# EasyEDA Pro project 双路12usb诱骗加热温控.eprj

# Schematic Schematic1
Board Name: Board1; Create Date: 2025-01-06; Page Name: P1; Project Name: 双路12usb诱骗加热温控; Schematic Name: Schematic1; Update Date: 2025-01-14; Company: 嘉立创EDA; Page Size: A4; Version: V1.0
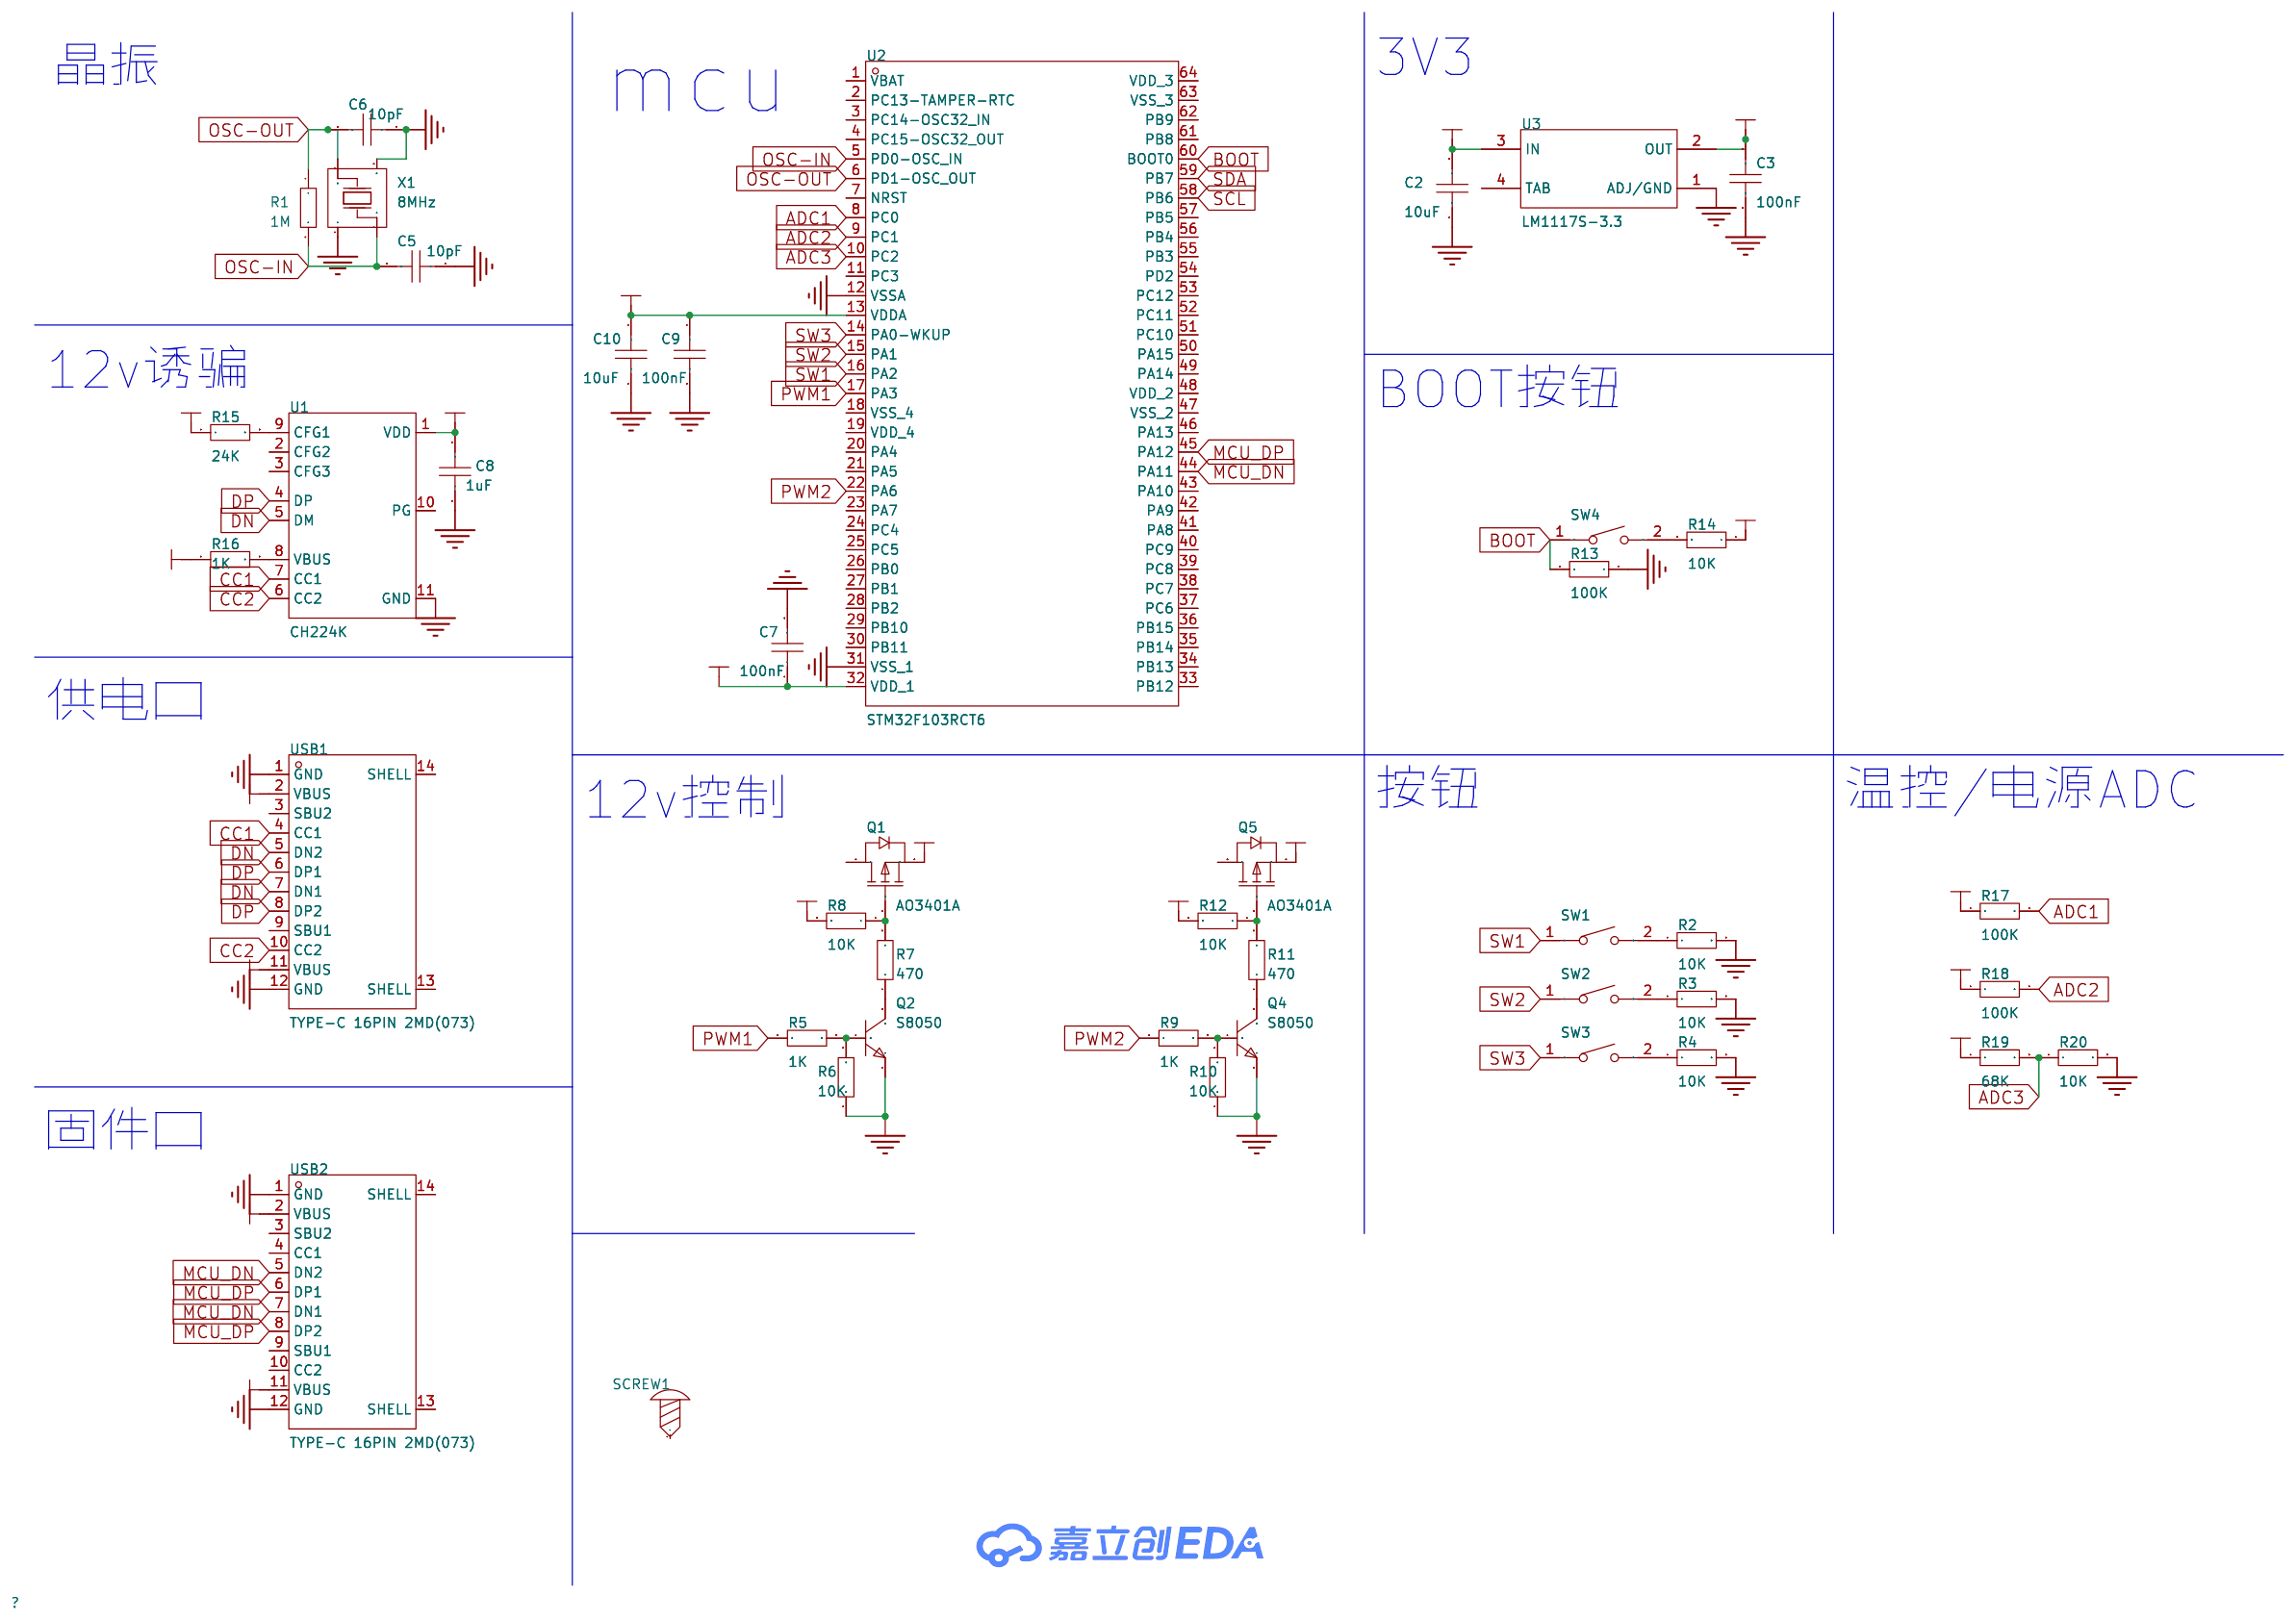
[diagram p0: schematic sheet]

## Parts
C2  10uF  [C0603]
C3  100nF  [C0603]
C5  10pF  [C0603]
C6  10pF  [C0603]
C7  100nF  [C0603]
C8  1uF  [C0603]
C9  100nF  [C0603]
C10  10uF  [C0603]
Q1  AO3401A  [SOT-23_L2.9-W1.3-P1.90-LS2.4-BR]
Q2  S8050  [SOT-23-3_L2.9-W1.3-P1.90-LS2.3-BR]
Q4  S8050  [SOT-23-3_L2.9-W1.3-P1.90-LS2.3-BR]
Q5  AO3401A  [SOT-23_L2.9-W1.3-P1.90-LS2.4-BR]
R1  1M  [R0603]
R2  10K  [R0603]
R3  10K  [R0603]
R4  10K  [R0603]
R5  1K  [R0603]
R6  10K  [R0603]
R7  470  [R0603]
R8  10K  [R0603]
R9  1K  [R0603]
R10  10K  [R0603]
R11  470  [R0603]
R12  10K  [R0603]
R13  100K  [R0603]
R14  10K  [R0603]
R15  24K  [R0603]
R16  1K  [R0603]
R17  100K  [R0603]
R18  100K  [R0603]
R19  68K  [R0603]
R20  10K  [R0603]
SCREW1  -  [M2螺丝]
SW1  TS-1088-AR02016  [SW-SMD_L3.9-W3.0-P4.45]
SW2  TS-1088-AR02016  [SW-SMD_L3.9-W3.0-P4.45]
SW3  TS-1088-AR02016  [SW-SMD_L3.9-W3.0-P4.45]
SW4  TS-1088-AR02016  [SW-SMD_L3.9-W3.0-P4.45]
U1  CH224K  [ESSOP-10_L4.9-W3.9-P1.0-LS6.0-TL-EP]
U2  STM32F103RCT6  [LQFP-64_L10.0-W10.0-P0.50-LS12.0-BL]
U3  LM1117S-3.3  [SOT-223-3_L6.5-W3.4-P2.30-LS7.0-BR]
USB1  TYPE-C 16PIN 2MD(073)  [USB-C-SMD_TYPE-C-6PIN-2MD-073]
USB2  TYPE-C 16PIN 2MD(073)  [USB-C-SMD_TYPE-C-6PIN-2MD-073]
X1  8MHz  [CRYSTAL-SMD_4P-L3.2-W2.5-BL]

## Library data of the parts
C2 C3 C5-C10 = CAP_0603: Supplier Footprint: 0603
Q1 Q5 = AO3401A_C15127: LCSC Part Name: 1个P沟道 耐压:30V 电流:4A; Supplier Part: C15127; Manufacturer: AOS; Supplier Footprint: SOT-23; JLCPCB Part Class: 基础库; Datasheet: https://atta.szlcsc.com/upload/public/pdf/source/20160507/1462613609053.pdf; Supplier: LCSC; Type: 1个P沟道; Drain Source Voltage (Vdss): 30V; Continuous Drain Current (Id): 4A; Drain Source On Resistance (RDS(on)@Vgs,Id): 44mΩ@10V,4.3A; Power Dissipation (Pd): 1.4W; Gate Threshold Voltage (Vgs(th)@Id): 1.3V@250uA; Total Gate Charge (Qg@Vgs): 12.2nC@4.5V; Input Capacitance (Ciss@Vds): 1.2nF@15V; Operating Temperature: -55℃~+150℃@(Tj)
Q2 Q4 = S8050_C20069125: LCSC Part Name: hFE:200-350，丝印:J3Y; Supplier Part: C20069125; Manufacturer: 宏迦橙; Supplier Footprint: SOT-23; JLCPCB Part Class: 扩展库; Datasheet: https://atta.szlcsc.com/upload/public/pdf/source/20240403/2D78449C96B6E27F13BF8BDF79E27159.pdf; Supplier: LCSC; Transistor Type: NPN; Collector Current (Ic): 500mA; Collector-Emitter Breakdown Voltage (Vceo): 25V; Power Dissipation (Pd): 300mW; DC Current Gain (hFE@Ic,Vce): 120@50mA,1.0V; Transition Frequency (fT): 100MHz; Collector Cut-Off Current (Icbo): 100nA; Collector-Emitter Saturation Voltage (VCE(sat)@Ic,Ib): 600mV@500mA,50mA; Operating Temperature: -55℃~+150℃
R1-R20 = Res_0603: Supplier Footprint: 0603
SCREW1 = M2螺丝: Supplier Footprint: 插件
SW1-SW4 = TS-1088-AR02016: LCSC Part Name: 4*3*2mm 立贴 轻触开关; Supplier Part: C720477; Manufacturer: XUNPU(讯普); Supplier Footprint: SMD; JLCPCB Part Class: 扩展库; Datasheet: https://atta.szlcsc.com/upload/public/pdf/source/20200810/C720475_60D09DD6C54279ADDB2DC25100F1CC11.pdf; Supplier: LCSC; Circuit: 单刀单掷; Actuator Style: 圆形按钮; Operating Force: 160gf; Mounting Style: 立贴; Switch Length: 4mm; Switch Width: 3mm; Switch Height: 2mm; Strike Gundam: 不带; Contact Current: 50mA; Voltage Rating (DC): 12V; Insulation Resistance: 100MΩ; Actuator/Cap Color: 黑色; Pin Style: SMD接片; Mechanical Life: 10万次; Operating Temperature: -30℃~+80℃
U1 = CH224K: LCSC Part Name: USBPD等多快充协议受电芯片CH224; Supplier Part: C970725; Manufacturer: WCH(南京沁恒); Supplier Footprint: ESSOP-10-150mil-1mm; JLCPCB Part Class: 扩展库; Datasheet: https://atta.szlcsc.com/upload/public/pdf/source/20240313/43C2AFDDBDD1F65B60386D2CCAB0811B.pdf; Supplier: LCSC
U2 = STM32F103RCT6: LCSC Part Name: 主流增强型ARM Cortex-M3 MCU，具有256 KB Flash、72 MHz CPU、电机控制、USB和CAN; Supplier Part: C8323; Manufacturer: ST(意法半导体); Supplier Footprint: LQFP-64(10x10); JLCPCB Part Class: 扩展库; Datasheet: https://atta.szlcsc.com/upload/public/pdf/source/20180207/C88442_15179953708671359491.pdf; Supplier: LCSC; CPU Core: ARM-M3; Program Storage Size: 256KB; RAM Size: 48KB; GPIO Ports Number: 51; Operating Voltage Range: 2V~3.6V; CPU Maximum Speed: 72MHz; Program Memory Type: FLASH; Operating Temperature Range: -40℃~+85℃; ADC (Bit): 12bit; DAC (Bit): 12bit; Universal Serial Bus: 有; Peripheral/Function: DMA；温度传感器；PWM; Watchdog: 有; Infrared Data Association: 有; Low-Voltage Detect: 有; Direct Memory Access: 有; Internal Oscillator: 有
U3 = LM1117S-3.3: LCSC Part Name: 输入12V 输出3.3V 1A; Supplier Part: C126027; Manufacturer: HTC; Supplier Footprint: SOT-223-3; JLCPCB Part Class: 扩展库; Datasheet: https://atta.szlcsc.com/upload/public/pdf/source/20170814/C126029_1502678374361885901.pdf; Supplier: LCSC; Output Type: 固定; Maximum Input Voltage: 12V; Output Voltage: 3.3V; MAX Output Current: 1A; Power Supply Rejection Ratio (PSRR): 75dB@(120Hz); Dropout Voltage: 1.3V@(1A); Output Polarity: 正极; Number of Outputs: 1
USB1 USB2 = TYPE-C 16PIN 2MD(073): LCSC Part Name: Type-C 母 卧贴; Supplier Part: C2765186; Manufacturer: SHOU HAN(首韩); Supplier Footprint: SMD; JLCPCB Part Class: 扩展库; Datasheet: https://atta.szlcsc.com/upload/public/pdf/source/20211123/39B17C16241EAC15C5E277BDA434118E.pdf; Supplier: LCSC; Connector Type: Type-C; Standard: USB 3.1; Gender: 母; Mounting Style: 卧贴; Number of Contacts: 16P; Number of Ports: 1; Current Rating - Power (Max): 5A; Operating Temperature Range: -25℃~+85℃; Rated Voltage (Max): 5V; Connect-Disconnect Life: 5千次; Core Colour: 黑色
X1 = TAXM8M4RDBCCT2T: LCSC Part Name: 8MHz ±10ppm 10pF; Supplier Part: C400090; Manufacturer: YJX(雅晶鑫); Supplier Footprint: SMD3225-4P; JLCPCB Part Class: 扩展库; Datasheet: https://atta.szlcsc.com/upload/public/pdf/source/20190626/C400090_CF95B89E745AFE4EF2E392EF8AC009D6.pdf; Supplier: LCSC; Crystal Type: 贴片晶振; Normal temperature Frequency Tolerance: ±10ppm; Load Capacitor: 10pF; Frequency Stability(Full temperature range): ±15ppm; Equivalent Series Resistance (ESR): 250Ω; Operating Temperature: -40℃~+85℃

## Nets
3V3: C3.2 C7.1 C9.1 C10.1 R14.1 R17.1 R18.1 U2.13(VDDA) U2.32(VDD_1) U3.2(OUT)
12V: C2.2 C8.1 Q1.2(S) Q5.2(S) R8.2 R12.2 R15.1 R16.1 R19.1 U1.1(VDD) U3.3(IN) USB1.2(VBUS) USB1.11(VBUS) USB2.2(VBUS) USB2.11(VBUS)
GND: C2.1 C3.1 C5.1 C6.1 C7.2 C8.2 C9.2 C10.2 Q2.2(E) Q4.2(E) R2.2 R3.2 R4.2 R6.1 R10.1 R13.1 R20.2 U1.11(GND) U2.12(VSSA) U2.31(VSS_1) U3.1(ADJ/GND) USB1.1(GND) USB1.12(GND) USB2.1(GND) USB2.12(GND) X1.2 X1.4
ADC1: R17.2 U2.8(PC0)
ADC2: R18.2 U2.9(PC1)
ADC3: R19.2 R20.1 U2.10(PC2)
BOOT: R13.2 SW4.1 U2.60(BOOT0)
CC1: U1.7(CC1) USB1.4(CC1)
CC2: U1.6(CC2) USB1.10(CC2)
DN: U1.5(DM) USB1.5(DN2) USB1.7(DN1)
DP: U1.4(DP) USB1.6(DP1) USB1.8(DP2)
MCU_DN: U2.44(PA11) USB2.5(DN2) USB2.7(DN1)
MCU_DP: U2.45(PA12) USB2.6(DP1) USB2.8(DP2)
OSC-IN: C5.2 R1.2 U2.5(PD0-OSC_IN) X1.1
OSC-OUT: C6.2 R1.1 U2.6(PD1-OSC_OUT) X1.3
PWM1: R5.1 U2.17(PA3)
PWM2: R9.1 U2.22(PA6)
SCL: U2.58(PB6)
SDA: U2.59(PB7)
SW1: SW1.1 U2.16(PA2)
SW2: SW2.1 U2.15(PA1)
SW3: SW3.1 U2.14(PA0-WKUP)
$1N2336: R2.1 SW1.2
$1N2362: R3.1 SW2.2
$1N2388: R4.1 SW3.2
$1N2785: Q2.1(B) R5.2 R6.2
$1N2909: Q2.3(C) R7.1
$1N2911: Q1.1(G) R7.2 R8.1
$1N3260: Q4.1(B) R9.2 R10.2
$1N3265: Q4.3(C) R11.1
$1N3267: Q5.1(G) R11.2 R12.1
$1N4506: R14.2 SW4.2
$1N5026: R15.2 U1.9(CFG1)
$1N5209: R16.2 U1.8(VBUS)

Not connected (* = marked no-connect by the designer): Q1 3(D); Q5 3(D); SCREW1 1; U1 2(CFG2) 3(CFG3) 10(PG); U2 1(VBAT) 2(PC13-TAMPER-RTC) 3(PC14-OSC32_IN) 4(PC15-OSC32_OUT) 7(NRST) 11(PC3) 18(VSS_4) 19(VDD_4) 20(PA4) 21(PA5) 23(PA7) 24(PC4) 25(PC5) 26(PB0) 27(PB1) 28(PB2) 29(PB10) 30(PB11) 33(PB12) 34(PB13) 35(PB14) 36(PB15) 37(PC6) 38(PC7) 39(PC8) 40(PC9) 41(PA8) 42(PA9) 43(PA10) 46(PA13) 47(VSS_2) 48(VDD_2) 49(PA14) 50(PA15) 51(PC10) 52(PC11) 53(PC12) 54(PD2) 55(PB3) 56(PB4) 57(PB5) 61(PB8) 62(PB9) 63(VSS_3) 64(VDD_3); U3 4(TAB); USB1 3(SBU2) 9(SBU1) 13(SHELL) 14(SHELL); USB2 3(SBU2) 4(CC1) 9(SBU1) 10(CC2) 13(SHELL) 14(SHELL)

## Notes on the sheet
- 晶振
- 3V3
- mcu
- 12v诱骗
- BOOT按钮
- 供电口
- 12v控制
- 按钮
- 温控/电源ADC
- 固件口

# Board PCB1
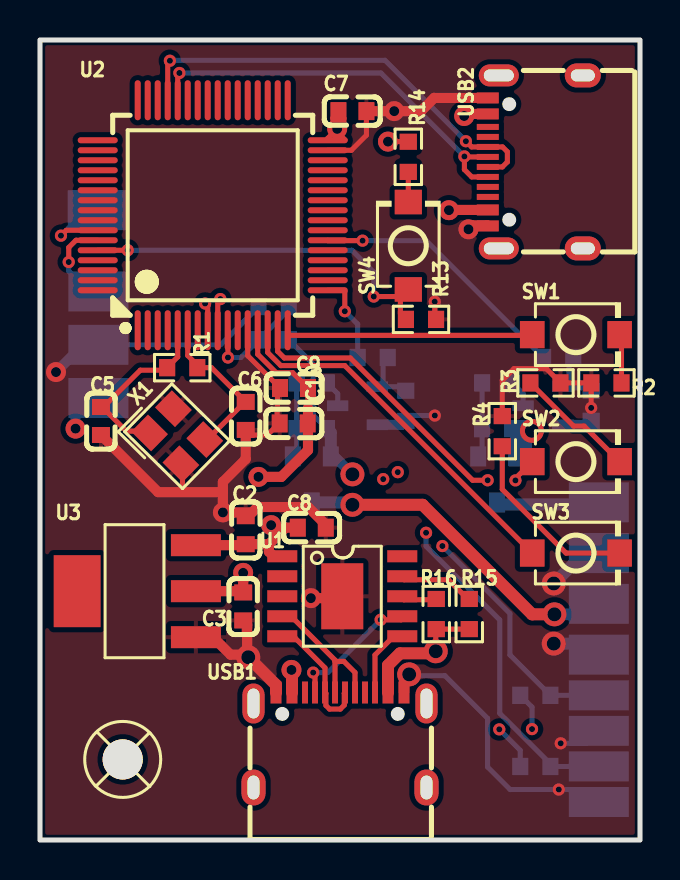
[diagram p1: board, top side]
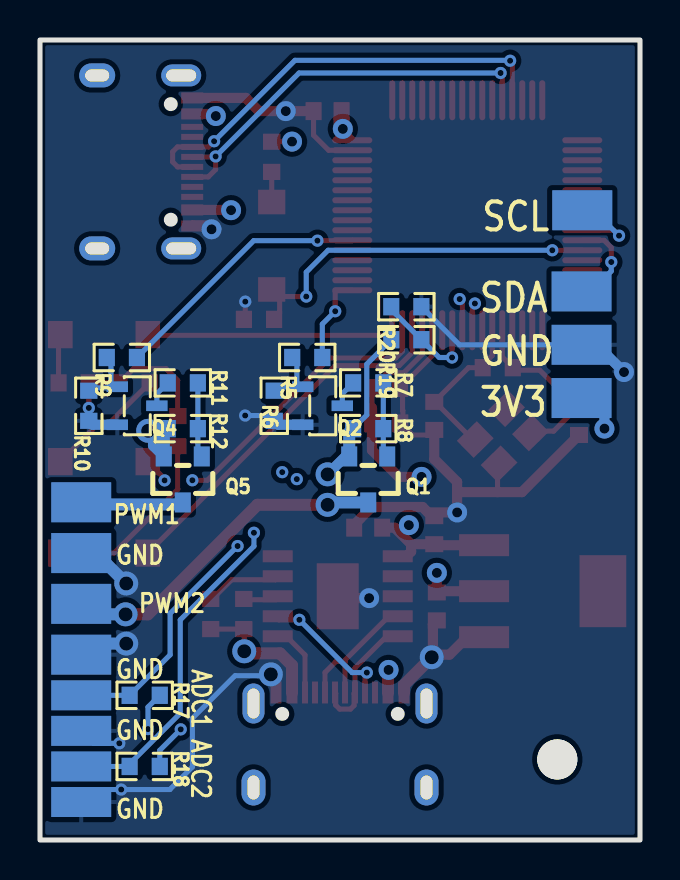
[diagram p2: board, bottom side, seen from below]

Outline 30 x 40 mm; copper layers: Top Layer, Inner1, Inner2, Bottom Layer. Coordinates in mm from the lower left corner of the outline.
Outline path: rectangle 0,40 30,0
Stack: Top Layer 0.035mm 外层铜厚1oz / Dielectric1 0.2104mm 7628 RC49% 8.6mil / Inner1 0.0152mm 内层铜厚 / Dielectric2 1.065mm 1.1mm H/HOZ Copper / Inner2 0.0152mm 内层铜厚 / Dielectric3 0.2104mm 7628 RC49% 8.6mil / Bottom Layer 0.035mm 外层铜厚1oz

## Design rules (mm)
template: 自定义配置1
spacing copperThickness1oz (default): track to track 0.102, other pairs 0.152 to 0.3
spacing copperThickness2oz: track to track 0.203, other pairs 0.152 to 0.3
spacing safeClearance1: track to track 0.152, other pairs 0.152 to 0.3
track width copperThickness1oz (default): min 0.127, default 0.254, max 2.54
track width copperThickness2oz: min 0.203, default 0.254, max 2.54
track width 10mil: min 0.254, default 0.254, max 0.254
track width 20mil: min 0.254, default 0.508, max 1
track width 6mil: min 0.152, default 0.152, max 0.152
track width 8mil: min 0.203, default 0.203, max 0.203
differential pair differentialPair (default): width min 0.127, default 0.254, max 2.54; gap min 0.152, default 0.152
via viaSize (default): diameter min 0.5, default 0.61, max 10; hole min 0.3, default 0.305, max 6.299
via 0.5-1.0: diameter min 0.5, default 1, max 1.5; hole min 0.3, default 0.5, max 1
net 12V uses 0.5-1.0, 20mil
net GND uses 0.5-1.0, 20mil
net 3V3 uses 0.5-1.0, 20mil

## Placement (name value [footprint] x y rotation side)
C2  10uF  [C0603]  10.29 15.49 270 top
C3  100nF  [C0603]  10.16 11.68 90 top
C5  10pF  [C0603]  3.05 20.95 90 top
C6  10pF  [C0603]  10.29 21.2 90 top
C7  100nF  [C0603]  15.62 36.44 0 top
C8  1uF  [C0603]  13.59 15.62 0 top
C9  100nF  [C0603]  12.7 22.6 180 top
C10  10uF  [C0603]  12.68 20.83 180 top
NOREF  -  [Pad_e78]  2.92 27.43 0 top
NOREF#2  -  [Pad_e449]  27.94 14.35 0 top
NOREF#3  -  [Pad_e79]  2.92 24.76 0 top
NOREF#4  -  [Pad_e80]  2.92 22.1 0 top
NOREF#5  -  [Pad_e99]  27.94 3.68 0 top
NOREF#6  -  [Pad_e450]  27.94 9.27 0 top
NOREF#7  -  [Pad_e75]  2.89 31.49 0 top
NOREF#8  -  [Pad_e270]  27.94 16.89 0 top
NOREF#9  -  [Pad_e98]  27.94 7.23 0 top
NOREF#10  -  [Pad_e271]  27.94 11.81 0 top
NOREF#11  -  [Pad_e101]  27.94 5.46 0 top
NOREF#12  -  [Pad_e111]  27.94 1.9 0 top
Q1  AO3401A  [SOT-23_L2.9-W1.3-P1.90-LS2.4-BR]  13.59 18.03 90 bottom
Q2  S8050  [SOT-23-3_L2.9-W1.3-P1.90-LS2.3-BR]  15.88 21.71 0 bottom
Q4  S8050  [SOT-23-3_L2.9-W1.3-P1.90-LS2.3-BR]  25.15 21.71 0 bottom
Q5  AO3401A  [SOT-23_L2.9-W1.3-P1.90-LS2.4-BR]  22.86 18.03 90 bottom
R1  1M  [R0603]  7.11 23.62 180 top
R2  10K  [R0603]  28.32 22.86 180 top
R3  10K  [R0603]  25.27 22.86 0 top
R4  10K  [R0603]  23.11 20.44 90 top
R5  1K  [R0603]  16.64 24.12 0 bottom
R6  10K  [R0603]  18.29 21.71 90 bottom
R7  470  [R0603]  13.59 22.86 180 bottom
R8  10K  [R0603]  13.59 20.57 0 bottom
R9  1K  [R0603]  25.91 24.12 0 bottom
R10  10K  [R0603]  27.56 21.71 90 bottom
R11  470  [R0603]  22.86 22.86 180 bottom
R12  10K  [R0603]  22.86 20.57 0 bottom
R13  100K  [R0603]  19.05 26.03 180 top
R14  10K  [R0603]  18.41 34.16 270 top
R15  24K  [R0603]  21.46 11.3 90 top
R16  1K  [R0603]  19.81 11.3 90 top
R17  100K  [R0603]  24.76 7.23 0 bottom
R18  100K  [R0603]  24.76 3.68 0 bottom
R19  68K  [R0603]  11.68 25.01 180 bottom
R20  10K  [R0603]  11.68 26.67 180 bottom
SCREW1  -  [M2螺丝]  4.13 4.03 0 top
SW1  TS-1088-AR02016  [SW-SMD_L3.9-W3.0-P4.45]  26.8 25.27 0 top
SW2  TS-1088-AR02016  [SW-SMD_L3.9-W3.0-P4.45]  26.8 18.92 0 top
SW3  TS-1088-AR02016  [SW-SMD_L3.9-W3.0-P4.45]  26.8 14.35 0 top
SW4  TS-1088-AR02016  [SW-SMD_L3.9-W3.0-P4.45]  18.41 29.71 90 top
U1  CH224K  [ESSOP-10_L4.9-W3.9-P1.0-LS6.0-TL-EP]  15.11 12.19 270 top
U2  STM32F103RCT6  [LQFP-64_L10.0-W10.0-P0.50-LS12.0-BL]  8.64 31.24 0 top
U3  LM1117S-3.3  [SOT-223-3_L6.5-W3.4-P2.30-LS7.0-BR]  4.83 12.44 0 top
USB1  TYPE-C 16PIN 2MD(073)  [USB-C-SMD_TYPE-C-6PIN-2MD-073]  15 5 0 top
USB2  TYPE-C 16PIN 2MD(073)  [USB-C-SMD_TYPE-C-6PIN-2MD-073]  24.76 33.9 90 top
X1  8MHz  [CRYSTAL-SMD_4P-L3.2-W2.5-BL]  6.86 20.19 315.5 top

## Footprints (pads in the part's own frame, mm; a bottom-side part is the same pattern mirrored in y, then rotated)
C0603
  rect 0.8x0.9 smd: 1(-0.7,0) 2(0.7,0)
CRYSTAL-SMD_4P-L3.2-W2.5-BL
  rect 1.4x1.2 smd: 1(-1.1,-0.85) 2(1.1,-0.85) 3(1.1,0.85) 4(-1.1,0.85)
ESSOP-10_L4.9-W3.9-P1.0-LS6.0-TL-EP
  rect 0.6x1.5 smd: 1(-2,-3) 2(-1,-3) 3(0,-3) 4(1,-3) 5(2,-3) 6(2,3) 7(1,3) 8(0,3) 9(-1,3) 10(-2,3)
  rect 3.3x2.1 smd: 11(0,0)
LQFP-64_L10.0-W10.0-P0.50-LS12.0-BL
  oval 0.3x2 smd: 1(-3.75,-5.75) 2(-3.25,-5.75) 3(-2.75,-5.75) 4(-2.25,-5.75) 5(-1.75,-5.75) 6(-1.25,-5.75) 7(-0.75,-5.75) 8(-0.25,-5.75) 9(0.25,-5.75) 10(0.75,-5.75) 11(1.25,-5.75) 12(1.75,-5.75) 13(2.25,-5.75) 14(2.75,-5.75) 15(3.25,-5.75) 16(3.75,-5.75) 33(3.75,5.75) 34(3.25,5.75) 35(2.75,5.75) 36(2.25,5.75) 37(1.75,5.75) 38(1.25,5.75) 39(0.75,5.75) 40(0.25,5.75) 41(-0.25,5.75) 42(-0.75,5.75) 43(-1.25,5.75) 44(-1.75,5.75) 45(-2.25,5.75) 46(-2.75,5.75) 47(-3.25,5.75) 48(-3.75,5.75)
  oval 2x0.3 smd: 17(5.75,-3.75) 18(5.75,-3.25) 19(5.75,-2.75) 20(5.75,-2.25) 21(5.75,-1.75) 22(5.75,-1.25) 23(5.75,-0.75) 24(5.75,-0.25) 25(5.75,0.25) 26(5.75,0.75) 27(5.75,1.25) 28(5.75,1.75) 29(5.75,2.25) 30(5.75,2.75) 31(5.75,3.25) 32(5.75,3.75) 49(-5.75,3.75) 50(-5.75,3.25) 51(-5.75,2.75) 52(-5.75,2.25) 53(-5.75,1.75) 54(-5.75,1.25) 55(-5.75,0.75) 56(-5.75,0.25) 57(-5.75,-0.25) 58(-5.75,-0.75) 59(-5.75,-1.25) 60(-5.75,-1.75) 61(-5.75,-2.25) 62(-5.75,-2.75) 63(-5.75,-3.25) 64(-5.75,-3.75)
M2螺丝
  round 2 hole 2: 1(0,0)
Pad_e75
  rect 3x2 smd far side: 1(0,0)
Pad_e78
  rect 3x2 smd far side: 1(0,0)
Pad_e79
  rect 3x2 smd far side: 1(0,0)
Pad_e80
  rect 3x2 smd far side: 1(0,0)
Pad_e98
  rect 3x1.5 smd far side: 1(0,0)
Pad_e99
  rect 3x1.5 smd far side: 1(0,0)
Pad_e101
  rect 3x1.5 smd far side: 1(0,0)
Pad_e111
  rect 3x1.5 smd far side: 1(0,0)
Pad_e270
  rect 3x2 smd far side: 1(0,0)
Pad_e271
  rect 3x2 smd far side: 1(0,0)
Pad_e449
  rect 3x2 smd far side: 1(0,0)
Pad_e450
  rect 3x2 smd far side: 1(0,0)
R0603
  rect 0.806x0.864 smd: 1(-0.753,0) 2(0.753,0)
SOT-23-3_L2.9-W1.3-P1.90-LS2.3-BR
  rect 1.07x0.532 smd: 1(0.99,-0.95) 2(0.99,0.95) 3(-0.99,0)
SOT-23_L2.9-W1.3-P1.90-LS2.4-BR
  rect 1x0.8 smd: 1(1.15,-0.95) 2(1.15,0.95) 3(-1.15,0)
SOT-223-3_L6.5-W3.4-P2.30-LS7.0-BR
  rect 2.5x1.1 smd: 1(2.97,-2.3) 2(2.97,0) 3(2.97,2.3)
  rect 2.34x3.6 smd: 4(-2.97,0)
SW-SMD_L3.9-W3.0-P4.45
  rect 1.23x1.36 smd: 1(-2.185,0) 2(2.185,0)
USB-C-SMD_TYPE-C-6PIN-2MD-073
  rect 0.55x1.1 smd: 1(-3.2,2.375) 2(-2.4,2.375) 11(2.4,2.375) 12(3.2,2.375)
  rect 0.3x1.1 smd: 3(-1.75,2.375) 4(-1.25,2.375) 5(-0.75,2.375) 6(-0.25,2.375) 7(0.25,2.375) 8(0.75,2.375) 9(1.25,2.375) 10(1.75,2.375)
  oval 1.1x2 hole 0.6x1.5: 13(-4.325,1.825) 14(4.325,1.825)
  oval 1.2x1.8 hole 0.6x1.2: 13(-4.325,-2.375) 14(4.325,-2.375)

## Nets
As in the schematic, except:
3V3: C3.2 C7.1 C9.1 C10.1 NOREF#4.1 R14.1 R17.1 R18.1 U2.13 U2.32 U3.2
GND: C2.1 C3.1 C5.1 C6.1 C7.2 C8.2 C9.2 C10.2 NOREF#2.1 NOREF#3.1 NOREF#6.1 NOREF#11.1 NOREF#12.1 Q2.2 Q4.2 R2.2 R3.2 R4.2 R6.1 R10.1 R13.1 R20.2 U1.11 U2.12 U2.31 U3.1 USB1.1 USB1.12 USB2.1 USB2.12 X1.2 X1.4
ADC1: NOREF#9.1 R17.2 U2.8
ADC2: NOREF#5.1 R18.2 U2.9
SCL: NOREF#7.1 U2.58
SDA: NOREF.1 U2.59

Pads without a net: NOREF#8 1; NOREF#10 1; Q1 3; Q5 3; SCREW1 1; U1 2 3 10; U2 1 2 3 4 7 11 18 19 20 21 23 24 25 26 27 28 29 30 33 34 35 36 37 38 39 40 41 42 43 46 47 48 49 50 51 52 53 54 55 56 57 61 62 63 64; U3 4; USB1 3 9 13 14; USB2 3 4 9 10 13 14

## Via types
v1: diameter 1.2, hole 0.7, Top Layer to Bottom Layer, 9 vias
v2: diameter 1, hole 0.5, Top Layer to Bottom Layer, 14 vias
v3: diameter 0.61, hole 0.305, Top Layer to Bottom Layer, 28 vias

## Routing (per net, layer and track width the routed paths; a pad name or vN(x,y) marks a point on that pad's centre or on a via; arc(x,y) is an arc through that point)
3V3: length 82.2
  Top Layer w0.254: 15.18,36.11 15.19,36.1 15.19,35.72 15.18,35.71 ; U2.32 14.39,35.08 v2(14.86,35.56) ; 14.91,35.56 14.65,35.82 14.65,36.1 14.65,36.1 ; 13.38,21.59 13.4,21.61 C9.1 12.64,23.36 11.81,23.36 10.89,24.29 U2.13 ; R14.1 18.41,34.92 v2(17.4,34.92) ; 15.25,35 15.06,35.2 15.06,35.28
  Top Layer w0.508: 13.4,21.61 13.4,19.49 12.06,18.16 v2(10.92,18.16) ; v2(10.16,13.36) 10.16,13.35 C3.2 10.1,12.44 U3.2
  Inner2 w0.254: v3(24.6,5.55) 24.59,5.53 v3(22.96,5.53) 14.44,5.53 11.79,8.18 11.79,11.72 v2(10.16,13.36)
  Inner2 w0.508: v2(14.86,35.56) 16.76,35.56 v2(17.4,34.92) 17.4,24.63 v2(10.92,18.16) 10.16,17.39 v2(10.16,13.36) 8.99,13.36 v2(1.78,20.57)
  Bottom Layer w0.254: v3(22.96,5.53) 24.01,4.48 R18.1 ; v3(24.6,5.55) 24.6,6.64 R17.1
  Bottom Layer w0.508: NOREF#4.1 2.42,22.1 1.78,21.46 v2(1.78,20.57)
12V: length 75.3
  Top Layer w0.254: v1(19.79,9.44) 19.79,10.52 R16.1 R15.1
  Top Layer w0.508: 11.44,14.79 12.27,15.62 C8.1 ; 11.44,14.79 11.44,14.42 11.55,14.32 ; 11.44,14.79 C2.2 10.24,14.74 U3.3 ; v2(21.21,36.2) 21.31,36.3 USB2.11 ; USB2.2 20.46,31.5 v2(20.45,31.49)
  Top Layer w0.6: USB1.2 12.6,8.48 v2(12.57,8.5) ; USB1.11 17.4,8.73 18,9.33 19.69,9.33 v1(19.79,9.44)
  Inner2 w0.508: 18.43,21.09 20.45,23.11 v2(20.45,31.49) 20.45,35.44 v2(21.21,36.2) ; v2(11.56,15.74) 14.55,15.74
  Inner2 w0.6: v2(12.57,8.5) 13.5,9.43 14.58,9.43 ; 14.57,15.76 14.57,17.23 v1(15.62,18.28) 18.43,21.09 19.06,20.46 v1(24.59,20.46) ; 14.57,15.76 14.57,9.44 14.58,9.43 ; 14.57,15.76 14.55,15.74 ; 14.58,9.43 14.58,9.44 v1(19.79,9.44)
  Bottom Layer w0.254: R8.2 13.66,21.25 13.66,23.79 R19.1
  Bottom Layer w0.508: Q1.2 14.72,19.18 v1(15.62,18.28) ; 23.69,20.75 24.29,20.75 24.34,20.7 ; 24.35,20.26 24.35,19.72 Q5.2
  Bottom Layer w0.6: Q5.2 23.81,20.37 R12.2 ; Q1.2 14.54,20.37 R8.2
GND: length 183.7
  Top Layer w0.254: U2.31 15.57,34.49 16.32,35.24 C7.2 ; 10.29,20.38 10.41,20.25 11.37,20.25 11.86,20.74 11.86,21.46 11.87,21.48 11.87,22.47 C9.2 10.39,24.22 U2.12 ; v3(27.56,21.61) 27.56,22.85 R2.2 R3.2 25.32,23.57 23.7,23.57 23.11,22.98 R4.2 ; 7.12,18.73 7.12,17.39 ; v3(19.74,26.92) 19.74,26.1 R13.1
  Top Layer w0.508: USB2.12 19.71,37.1 19.05,36.44 v2(17.71,36.44) C7.2 ; C3.1 10.36,10.78 10.36,9.59 10.03,9.27 9.53,9.27 8.65,10.14 U3.1 ; C5.1 5.9,17.39 9.14,17.39 9.14,17.4 ; 9.14,17.4 9.14,17.9 10.29,19.05 10.29,20.38 ; 9.14,17.4 v2(9.14,16.38) 10.6,16.38 10.87,16.65 13.41,16.65 14.29,15.77 C8.2 ; v2(13.54,12.09) 15.14,12.09 ; v1(18.46,8.28) 18.2,8.02 USB1.12 ; v2(21.42,30.53) 21.62,30.73 22.37,30.73 USB2.1
  Top Layer w0.6: USB1.1 11.8,7.75 10.3,9.25
  Inner1 w0.254: v3(19.74,21.22) 21.3,21.22 21.36,21.17 ; v3(27.56,21.61) 21.42,21.61 ; v3(26.03,4.83) 25.94,4.74 v3(25.94,2.52) ; v3(19.74,26.92) 21.42,26.92 21.42,26.92
  Inner1 w0.508: v2(17.71,36.44) 21.42,32.73 v2(21.42,30.53) 21.42,19.97 v2(13.54,12.09) ; v1(25.69,9.82) 24.15,8.28 v1(18.46,8.28) ; v2(13.54,12.09) 17.35,8.28 v1(18.46,8.28) ; v2(13.54,12.09) 9.26,16.38 v2(9.14,16.38) 2.92,16.38 0.8,18.5 v2(0.8,23.4) ; v2(13.54,12.09) 10.59,9.14 v1(10.41,9.14) ; v1(18.46,8.28) 18.46,11.47 19.82,12.83 v1(25.69,12.83)
  Bottom Layer w0.254: v3(19.74,21.22) 18.55,21.22 R6.1 ; v3(26.03,4.83) 27.32,4.83 NOREF#11.1 ; R20.2 9.03,24.76 NOREF#3.1 ; NOREF#12.1 27.32,2.52 v3(25.94,2.52) 23.51,2.52 22.38,3.65 22.38,6.08 20.25,8.22 18.52,8.22 v1(18.46,8.28)
  Bottom Layer w0.508: R10.1 27.36,20.76 Q4.2 ; Q2.2 18.09,20.76 R6.1 ; v2(0.8,23.4) 2.16,24.76 NOREF#3.1
  Bottom Layer w0.6: NOREF#6.1 27.39,9.82 v1(25.69,9.82) ; NOREF#2.1 27.21,14.35 v1(25.69,12.83)
(no net): length 21.8
  Top Layer w0.6: v1(25.72,11.28) 24.61,11.28 19.13,16.76 v1(15.62,16.76)
  Bottom Layer w0.6: 13.59,16.88 15.5,16.88 v1(15.62,16.76) ; 27.7,16.65 27.58,16.78 23.09,16.78 22.99,16.88 22.86,16.88 ; NOREF#10.1 27.42,11.28 v1(25.72,11.28)
ADC1: length 31.2
  Top Layer w0.254: U2.8 8.39,26.69 v3(8.25,26.83)
  Inner1 w0.254: v3(17.16,18.04) 17.16,18.08 8.41,26.83 v3(8.25,26.83)
  Inner2 w0.254: v3(20.12,14.7) 20.04,14.78 19.06,14.78 18.72,15.12 18.72,16.48 v3(17.16,18.04)
  Bottom Layer w0.254: NOREF#9.1 R17.2 23.5,9.26 23.5,11.32 v3(20.12,14.7)
ADC2: length 34.4
  Top Layer w0.254: v3(9.02,27.05) 8.89,26.92 U2.9
  Inner1 w0.254: v3(17.89,18.39) 17.76,18.39 9.11,27.05 v3(9.02,27.05)
  Inner2 w0.254: v3(17.89,18.39) 17.93,18.39 19.3,17.01 v3(19.3,15.36)
  Bottom Layer w0.254: NOREF#5.1 R18.2 25.52,3.8 22.99,6.33 22.99,11.01 19.3,14.69 v3(19.3,15.36)
ADC3: length 5.7
  Top Layer w0.254: v3(9.4,24.12) 9.4,25.48 U2.10
  Bottom Layer w0.254: 12.44,26.79 12.44,26.52 R19.2 10.04,24.12 v3(9.4,24.12)
BOOT: length 17.7
  Top Layer w0.254: 18.02,26.31 18.02,26.9 ; U2.60 v3(4.39,29.49) ; v3(16.69,27.17) 18.3,27.17
  Bottom Layer w0.254: v3(4.39,29.49) 15.59,29.49 16.69,28.39 v3(16.69,27.17)
CC1: length 6.6
  Top Layer w0.254: USB1.4 13.75,8.28 v3(13.66,8.37) ; v3(17.03,11.01) 18.06,11.01 18.14,11.09
  Bottom Layer w0.254: v3(17.03,11.01) 14.39,8.37 v3(13.66,8.37)
CC2: length 3.6
  Top Layer w0.254: USB1.10 16.75,9.25 17.59,10.09 18.14,10.09
DN: length 6.3
  Top Layer w0.254: 12.14,10.09 12.76,10.09 14.25,8.61 USB1.5 14.3,7.33 14.3,6.73 14.48,6.55 15.02,6.55 15.21,6.75 15.21,7.34 USB1.7
DP: length 7.3
  Top Layer w0.254: 12.14,11.09 12.65,11.09 14.75,8.99 14.75,8.93 ; 14.75,8.93 15.2,8.93 15.75,8.38 USB1.8 ; 14.75,8.93 USB1.6
MCU_DN: length 20.5
  Top Layer w0.254: USB2.5 21.59,33.15 21.22,33.52 v3(21.22,34.18) 21.24,34.15 USB2.7 ; v3(6.97,38.35) 6.89,38.27 U2.44
  Bottom Layer w0.254: v3(21.22,34.18) 17.05,38.35 6.97,38.35 v3(6.97,38.35)
MCU_DP: length 22.4
  Top Layer w0.254: USB2.6 23.12,33.65 23.37,33.9 23.37,34.41 23.13,34.65 USB2.8 21.58,34.65 v3(21.29,34.94) ; U2.45 6.39,38.85 v3(6.49,38.96)
  Bottom Layer w0.254: v3(21.29,34.94) 17.25,38.98 6.52,38.98 v3(6.49,38.96)
OSC-IN: length 9.2
  Top Layer w0.254: 3.11,21.65 4.32,20.44 5.52,20.44 5.6,20.35 ; 3.11,21.65 C5.2 ; 3.11,21.65 3.18,21.65 5.01,23.49 6.22,23.49 6.89,24.15 U2.5
OSC-OUT: length 7.8
  Top Layer w0.254: 8.37,20.02 10.25,21.9 C6.2 8.57,23.62 7.99,23.62 7.39,24.22 U2.6
PWM1: length 4.4
  Top Layer w0.254: U2.17 15.18,27.49 15.24,27.43 v3(15.24,26.44)
  Bottom Layer w0.254: R5.1 15.88,25.79 v3(15.24,26.44)
PWM2: length 13.2
  Top Layer w0.254: v3(16.13,29.97) 14.41,29.97 U2.22
  Bottom Layer w0.254: R9.1 19.31,29.97 v3(16.13,29.97)
SCL: length 4.3
  Top Layer w0.254: U2.58 1.32,30.49 v3(1.05,30.22)
  Bottom Layer w0.254: NOREF#7.1 2.26,30.86 1.69,30.86 v3(1.05,30.22)
SDA: length 4.7
  Top Layer w0.254: v3(1.44,28.9) 1.44,28.9 1.44,29.63 1.8,29.99 U2.59
  Bottom Layer w0.254: v3(1.44,28.9) 1.44,28.44 2.45,27.43 NOREF.1
SW1: length 12.6
  Top Layer w0.254: U2.16 12.39,25.33 12.48,25.23 24.7,25.23 24.74,25.27
SW2: length 16.9
  Top Layer w0.254: U2.15 11.89,24.43 12.22,24.1 15.52,24.1 21.63,17.99 v3(22.38,17.99) ; SW2.1 23.77,18.08 v3(23.77,17.98)
  Inner1 w0.254: v3(22.38,17.99) 23.77,17.99 v3(23.77,17.98)
SW3: length 18.5
  Top Layer w0.254: U2.14 11.39,24.38 12.04,23.72 15.24,23.72 SW3.1
$1N2336: length 2.5
  Top Layer w0.254: R2.1 29.07,25.18 SW1.2
$1N2362: length 6.1
  Top Layer w0.254: SW2.2 27.2,20.7 26.68,20.7 R3.1
$1N2388: length 9.3
  Top Layer w0.254: R4.1 23.11,17.53 26.3,14.35 SW3.2
$1N2785: length 2.9
  Bottom Layer w0.254: R5.2 17.15,23.89 17.15,22.87 ; Q2.1 18.09,22.66 R6.2
$1N2909: length 1.4
  Bottom Layer w0.254: R7.1 14.88,22.31 Q2.3
$1N2911: length 3.8
  Bottom Layer w0.254: Q1.1 12.84,19.38 R8.1 R7.2
$1N3260: length 2.3
  Bottom Layer w0.254: 26.49,22.65 26.45,22.69 26.45,24.02 26.49,24.05 ; 27.3,22.58 27.27,22.61 26.48,22.61
$1N3265: length 1.4
  Bottom Layer w0.254: Q4.3 24.16,22.31 R11.1
$1N3267: length 3.8
  Bottom Layer w0.254: R11.2 R12.1 22.11,19.38 Q5.1
$1N4506: length 1.5
  Top Layer w0.254: SW4.2 R14.2
$1N5026: length 3.8
  Top Layer w0.254: R15.2 21.38,12.05 20.42,13.01 18.22,13.01 18.14,13.09
$1N5209: length 1.7
  Top Layer w0.254: 18.14,12.09 18.14,12.06 18.19,12.01 19.78,12.01 R16.2

## Copper pours and planes (outline as drawn; the poured copper is in the pictures)
GND on Top Layer: 0,40 30,40 30,0 0,0
GND on Bottom Layer: -0.13,40 29.97,40 29.97,-0.26 -0.13,-0.26
GND on Inner1: 0,40 29.97,40 29.97,-0.13 0,-0.13
GND on Inner2: 0,40 29.97,40 29.97,-0.26 0,-0.26

## Text on the board
Bottom Silkscreen Layer: PWM2 | GND | PWM1 | ADC1 | ADC2 | SCL | SDA | 3V3
